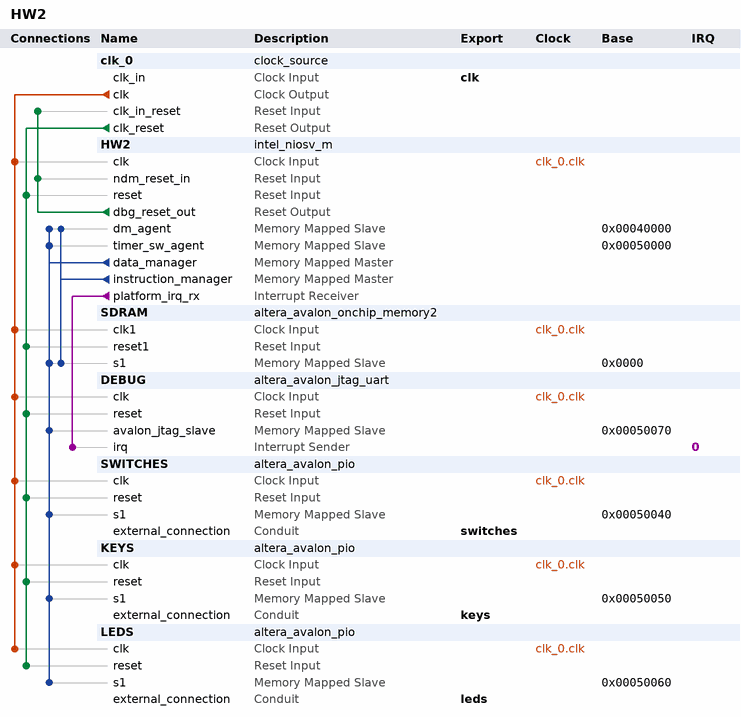
[diagram p0: system contents]
# Platform Designer (Qsys) system HW2, Cyclone V 5CSXFC6D6F31C6
# Parameters at their usual value, and those the tool derives, are not listed.
package require -exact qsys 24.1
create_system HW2
set_project_property DEVICE_FAMILY {Cyclone V}
set_project_property DEVICE 5CSXFC6D6F31C6

add_instance clk_0 clock_source 24.1
set_instance_parameter_value clk_0 clockFrequency 50000000

add_instance HW2 intel_niosv_m 26.0.0
set_instance_parameter_value HW2 enableAvalonInterface false
set_instance_parameter_value HW2 enableDebugReset true
set_instance_parameter_value HW2 enableECCLite false
set_instance_parameter_value HW2 hartId 0
set_instance_parameter_value HW2 interruptMode 0
set_instance_parameter_value HW2 pipelineArch true
set_instance_parameter_value HW2 resetSlave Absolute

add_instance SDRAM altera_avalon_onchip_memory2 24.1
set_instance_parameter_value SDRAM dataWidth 32
set_instance_parameter_value SDRAM dualPort false
set_instance_parameter_value SDRAM initMemContent true
set_instance_parameter_value SDRAM initializationFileName onchip_mem.hex
set_instance_parameter_value SDRAM memorySize 204800

add_instance DEBUG altera_avalon_jtag_uart 24.1
set_instance_parameter_value DEBUG simInteractiveOptions NO_INTERACTIVE_WINDOWS

add_instance SWITCHES altera_avalon_pio 24.1
set_instance_parameter_value SWITCHES direction Input
set_instance_parameter_value SWITCHES width 10

add_instance KEYS altera_avalon_pio 24.1
set_instance_parameter_value KEYS direction Input
set_instance_parameter_value KEYS width 4

add_instance LEDS altera_avalon_pio 24.1
set_instance_parameter_value LEDS direction Output
set_instance_parameter_value LEDS width 10

# connections
add_connection clk_0.clk DEBUG.clk clock
add_connection clk_0.clk HW2.clk clock
add_connection clk_0.clk KEYS.clk clock
add_connection clk_0.clk LEDS.clk clock
add_connection clk_0.clk SDRAM.clk1 clock
add_connection clk_0.clk SWITCHES.clk clock
add_connection clk_0.clk_reset DEBUG.reset reset
add_connection clk_0.clk_reset HW2.reset reset
add_connection clk_0.clk_reset KEYS.reset reset
add_connection clk_0.clk_reset LEDS.reset reset
add_connection clk_0.clk_reset SDRAM.reset1 reset
add_connection clk_0.clk_reset SWITCHES.reset reset
add_connection HW2.dbg_reset_out clk_0.clk_in_reset reset
add_connection HW2.dbg_reset_out HW2.ndm_reset_in reset
add_connection HW2.data_manager DEBUG.avalon_jtag_slave avalon
set_connection_parameter_value HW2.data_manager/DEBUG.avalon_jtag_slave baseAddress 0x00050070
add_connection HW2.data_manager HW2.dm_agent avalon
set_connection_parameter_value HW2.data_manager/HW2.dm_agent baseAddress 0x00040000
add_connection HW2.data_manager HW2.timer_sw_agent avalon
set_connection_parameter_value HW2.data_manager/HW2.timer_sw_agent baseAddress 0x00050000
add_connection HW2.data_manager KEYS.s1 avalon
set_connection_parameter_value HW2.data_manager/KEYS.s1 baseAddress 0x00050050
add_connection HW2.data_manager LEDS.s1 avalon
set_connection_parameter_value HW2.data_manager/LEDS.s1 baseAddress 0x00050060
add_connection HW2.data_manager SDRAM.s1 avalon
set_connection_parameter_value HW2.data_manager/SDRAM.s1 baseAddress 0x0000
add_connection HW2.data_manager SWITCHES.s1 avalon
set_connection_parameter_value HW2.data_manager/SWITCHES.s1 baseAddress 0x00050040
add_connection HW2.instruction_manager HW2.dm_agent avalon
set_connection_parameter_value HW2.instruction_manager/HW2.dm_agent baseAddress 0x00040000
add_connection HW2.instruction_manager SDRAM.s1 avalon
set_connection_parameter_value HW2.instruction_manager/SDRAM.s1 baseAddress 0x0000
add_connection HW2.platform_irq_rx DEBUG.irq interrupt
set_connection_parameter_value HW2.platform_irq_rx/DEBUG.irq irqNumber 0

# exported interfaces
add_interface clk clock sink
set_interface_property clk EXPORT_OF clk_0.clk_in
add_interface keys conduit end
set_interface_property keys EXPORT_OF KEYS.external_connection
add_interface leds conduit end
set_interface_property leds EXPORT_OF LEDS.external_connection
add_interface switches conduit end
set_interface_property switches EXPORT_OF SWITCHES.external_connection

set_interconnect_requirement {$system} qsys_mm.clockCrossingAdapter HANDSHAKE
set_interconnect_requirement {$system} qsys_mm.enableEccProtection FALSE
set_interconnect_requirement {$system} qsys_mm.insertDefaultSlave FALSE
set_interconnect_requirement {$system} qsys_mm.maxAdditionalLatency 1

save_system HW2.qsys
